# EAGLE design cpLeoNode_V3_0 (EAGLE 7.7.0)
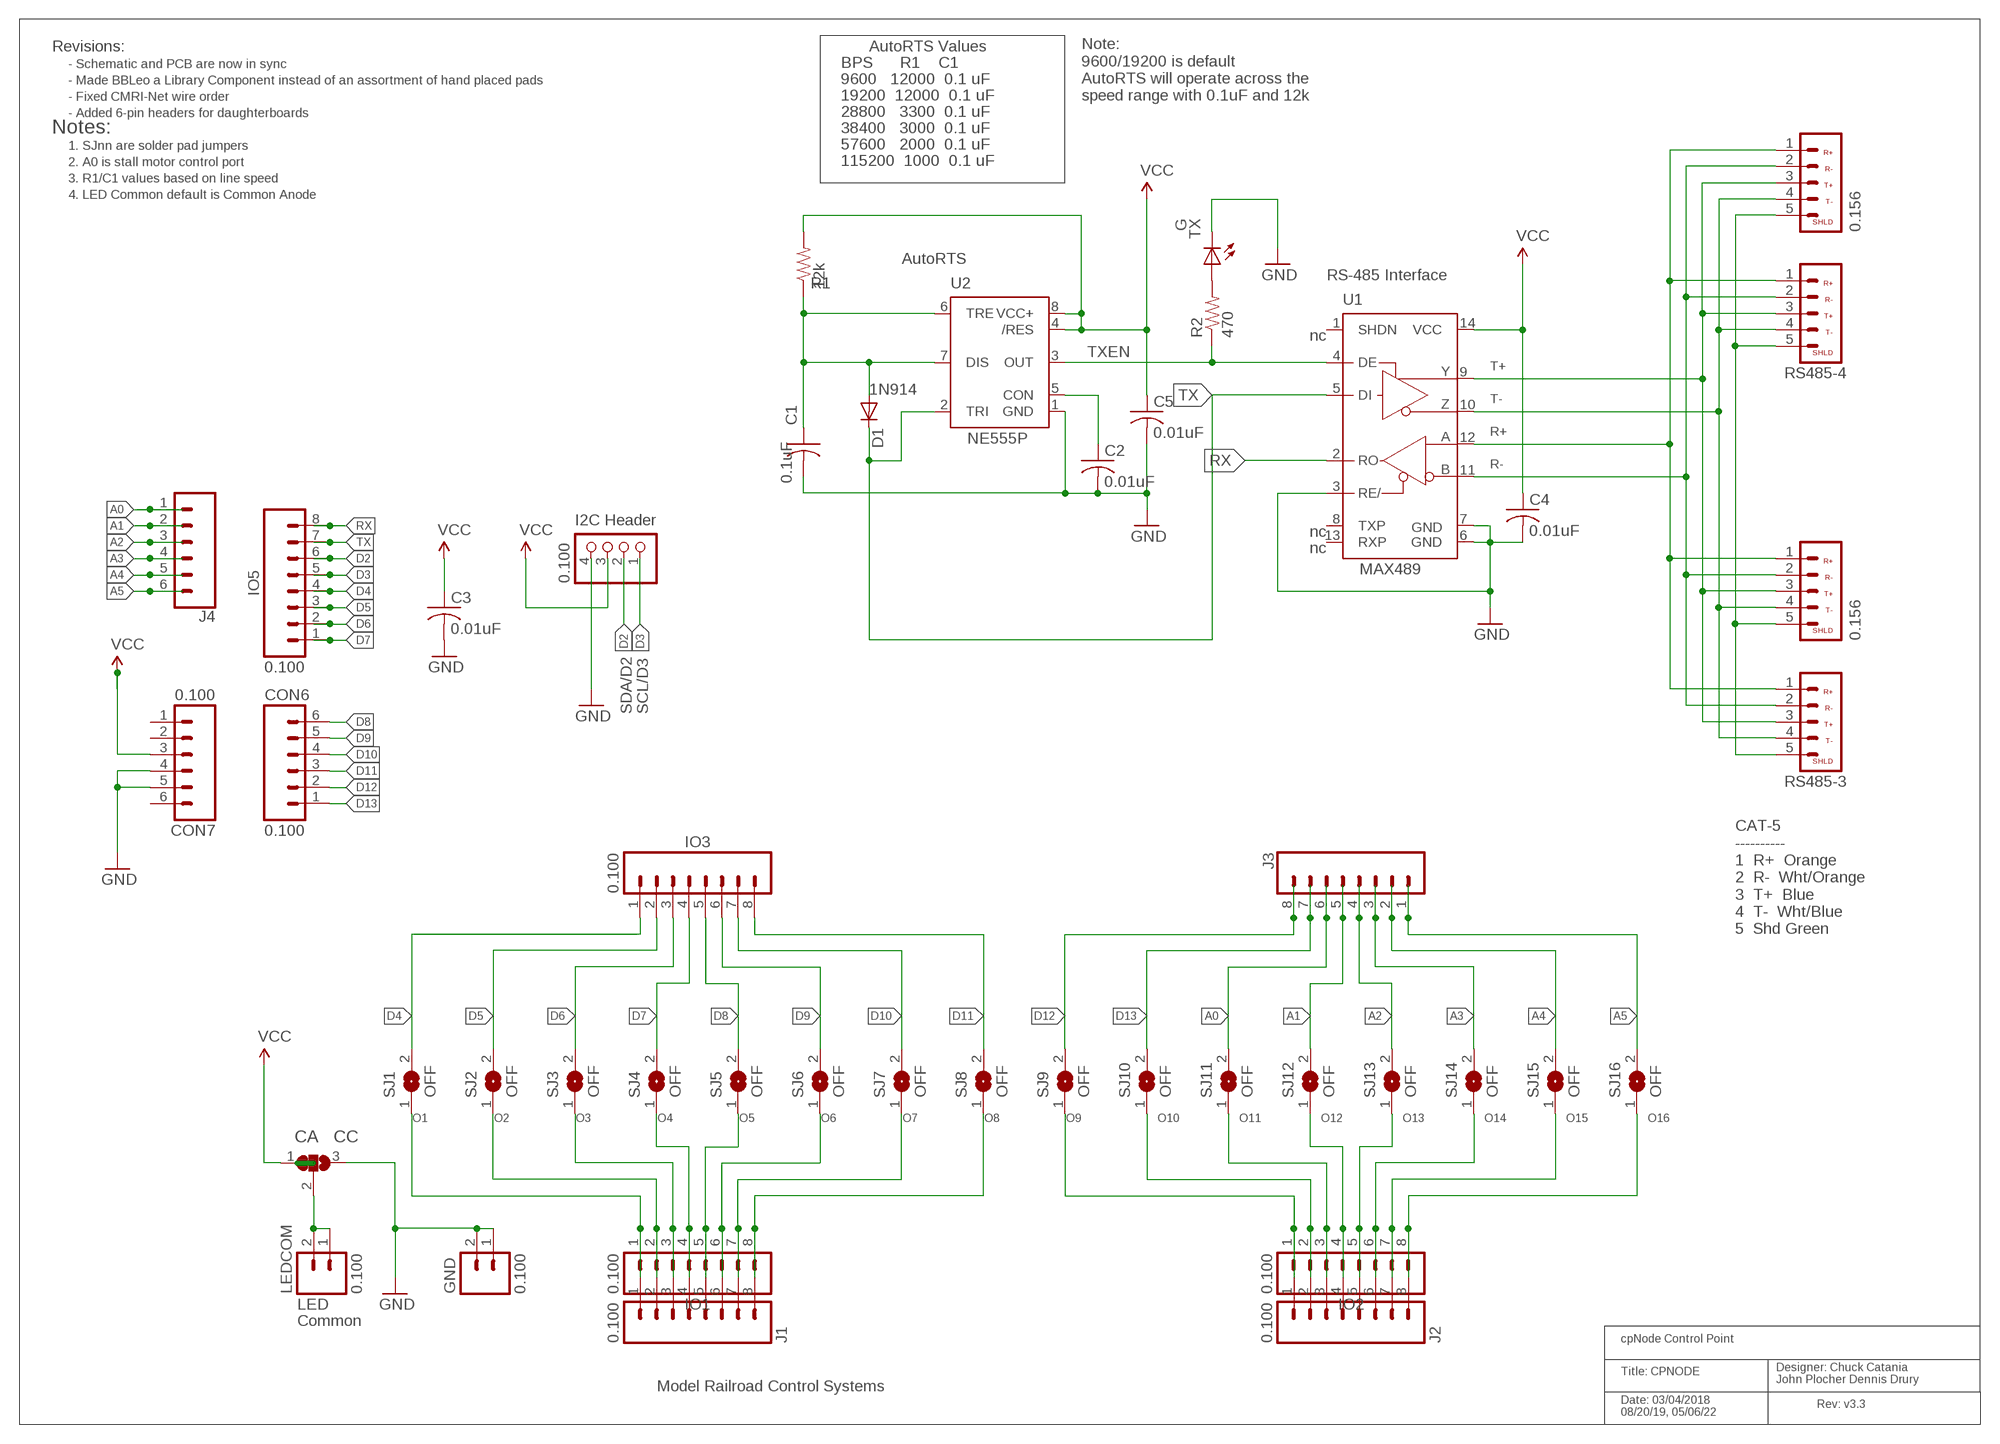
[diagram p0: schematic, sheet 1]

## Parts
C1  0.1uF  CAPPTH2  [C-PTH-0.100]
C2  0.01uF  CAPPTH2  [C-PTH-0.100]
C3  0.01uF  CAPPTH2  [C-PTH-0.100]
C4  0.01uF  CAPPTH2  [C-PTH-0.100]
C5  0.01uF  CAPPTH2  [C-PTH-0.100]
CON6  0.100  CONNECTOR-M06SIP_LOCK  [1X06-SIP_LOCK]
CON7  0.100  CONNECTOR-M06SIP_LOCK  [1X06-SIP_LOCK]
D1  1N4148  DIODE1N4148  [DIODE-1N4148]
GND  0.100  M02POLAR_LOCK  [MOLEX-1X2_LOCK]
I2CHDR  0.100  PINHD-1X4/90  [1X04/90]
IO1  0.100  M081X08  [1X08]
IO2  0.100  M081X08  [1X08]
IO3  0.100  M081X08  [1X08]
IO5  0.100  M081X08  [1X08]
J1  0.100  CONNECTOR-M08LOCK_LONGPADS  [1X08_LOCK_LONGPADS]
J2  0.100  CONNECTOR-M08LOCK_LONGPADS  [1X08_LOCK_LONGPADS]
J3  CONN_08"  [1X08]
J4  CONN_06SILK_FEMALE_PTH  [1X06]
LEDCOM  0.100  M02POLAR_LOCK  [MOLEX-1X2_LOCK]
P1  CA CC  PAD-SOLDERJUMPER-2WAYT  [3P-SMD-2X4.8]
R1  12k  RPTH04  [AXIAL-0.4-RES]
R2  470  RPTH04  [AXIAL-0.4-RES]
RS485-1  0.156  CONNECTOR-CMRINET.156  [KK-156-5]
RS485-2  0.156  CONNECTOR-CMRINET.156  [KK-156-5]
RS485-3  3.5mm  CONNECTOR-CMRINET3.5MM  [CMRINET-3.5MM]
RS485-4  3.5mm  CONNECTOR-CMRINET3.5MM  [CMRINET-3.5MM]
SJ1  OFF  SJ  [SJ]
SJ2  OFF  SJ  [SJ]
SJ3  OFF  SJ  [SJ]
SJ4  OFF  SJ  [SJ]
SJ5  OFF  SJ  [SJ]
SJ6  OFF  SJ  [SJ]
SJ7  OFF  SJ  [SJ]
SJ8  OFF  SJ  [SJ]
SJ9  OFF  SJ  [SJ]
SJ10  OFF  SJ  [SJ]
SJ11  OFF  SJ  [SJ]
SJ12  OFF  SJ  [SJ]
SJ13  OFF  SJ  [SJ]
SJ14  OFF  SJ  [SJ]
SJ15  OFF  SJ  [SJ]
SJ16  OFF  SJ  [SJ]
TX  G  LEDLED3MM  [LED3MM]
U1  MAX3465CPD  [DIL14]
U2  NE555P  [DIL-08]

## Nets
A0: J3.6 J4.1 SJ11.2
A1: J3.5 J4.2 SJ12.2
A2: J3.4 J4.3 SJ13.2
A3: J3.3 J4.4 SJ14.2
A4: J3.2 J4.5 SJ15.2
A5: J3.1 J4.6 SJ16.2
D2: I2CHDR.2 IO5.6
D3: I2CHDR.1 IO5.5
D4: IO3.1 IO5.4 SJ1.2
D5: IO3.2 IO5.3 SJ2.2
D6: IO3.3 IO5.2 SJ3.2
D7: IO3.4 IO5.1 SJ4.2
D8: CON6.6 IO3.5 SJ5.2
D9: CON6.5 IO3.6 SJ6.2
D10: CON6.4 IO3.7 SJ7.2
D11: CON6.3 IO3.8 SJ8.2
D12: CON6.2 J3.8 SJ9.2
D13: CON6.1 J3.7 SJ10.2
GND: C1.2 C2.2 C3.2 C4.2 C5.2 CON7.4 CON7.5 GND.1 GND.2 I2CHDR.4 P1.3 TX.K(C) U1.3(RE/) U1.6(GND) U1.7(GND) U2.1(GND)
N$29: R2.P$2 TX.A
N$38: C2.1 U2.5(CON)
N$45: LEDCOM.1 LEDCOM.2 P1.2
N$52: C1.1 D1.A R1.P$1 U2.6(TRE) U2.7(DIS)
N$54: R2.P$1 U1.4(DE) U2.3(OUT)
O1: IO1.1 J1.1 SJ1.1
O2: IO1.2 J1.2 SJ2.1
O3: IO1.3 J1.3 SJ3.1
O4: IO1.4 J1.4 SJ4.1
O5: IO1.5 J1.5 SJ5.1
O6: IO1.6 J1.6 SJ6.1
O7: IO1.7 J1.7 SJ7.1
O8: IO1.8 J1.8 SJ8.1
O9: IO2.1 J2.1 SJ9.1
O10: IO2.2 J2.2 SJ10.1
O11: IO2.3 J2.3 SJ11.1
O12: IO2.4 J2.4 SJ12.1
O13: IO2.5 J2.5 SJ13.1
O14: IO2.6 J2.6 SJ14.1
O15: IO2.7 J2.7 SJ15.1
O16: IO2.8 J2.8 SJ16.1
R+: RS485-1.1 RS485-2.1 RS485-3.1 RS485-4.1 U1.12(A)
R-: RS485-1.2 RS485-2.2 RS485-3.2 RS485-4.2 U1.11(B)
RX: IO5.8 U1.2(RO)
SHIELD: RS485-1.5 RS485-2.5 RS485-3.5 RS485-4.5
T+: RS485-1.3 RS485-2.3 RS485-3.3 RS485-4.3 U1.9(Y)
T-: RS485-1.4 RS485-2.4 RS485-3.4 RS485-4.4 U1.10(Z)
TX: D1.C IO5.7 U1.5(DI) U2.2(TRI)
VCC: C3.1 C4.1 C5.1 CON7.3 I2CHDR.3 P1.1 R1.P$2 U1.14(VCC) U2.4(/RES) U2.8(VCC+)
Unconnected: CON7.1 CON7.2 CON7.6 U1.1(SHDN) U1.8(TXP) U1.13(RXP)

## Notes on the sheet
- Revisions: | AutoRTS Values
- - Schematic and PCB are now in sync | BPS      R1    C1
- - Made BBLeo a Library Component instead of an assortment of hand placed pads | 9600   12000  0.1 uF
- - Fixed CMRI-Net wire order | 19200  12000  0.1 uF
- Note: 
  9600/19200 is default
  AutoRTS will operate across the
  speed range with 0.1uF and 12k
- - Added 6-pin headers for daughterboards | 28800   3300  0.1 uF
- Notes: | 38400   3000  0.1 uF
- 1. SJnn are solder pad jumpers | 57600   2000  0.1 uF
- 2. A0 is stall motor control port | 115200  1000  0.1 uF
- 3. R1/C1 values based on line speed
- 4. LED Common default is Common Anode
- AutoRTS
- RS-485 Interface
- nc
- TXEN
- T+
- 1N914
- T-
- R+
- R-
- I2C Header | nc
- nc
- MAX489
- SDA/D2 | SCL/D3
- CAT-5
  ----------
  1  R+  Orange
  2  R-  Wht/Orange
  3  T+  Blue
  4  T-  Wht/Blue
  5  Shd Green
- LED
- Common
- cpNode Control Point
- Title: CPNODE
- Designer: Chuck Catania
  John Plocher Dennis Drury
- Model Railroad Control Systems
- Rev: v3.3
- Date: 03/04/2018
  08/20/19, 05/06/22

## Library data of the parts
C1-C5 = SPCoast:CAP*
CON6 CON7 = SPCoast:CONNECTOR-M06: Header 6 Standard 6-pin 0.1" header
D1 = SPCoast:DIODE: Diode These are standard reverse protection diodes and small signal diodes. SMA package can handle up to about 1A. SOD-323 can handle about 200mA. What the SOD-323 package when ordering, there are some mfgs out there that are 5-pin packages.
GND LEDCOM = SparkFun:M02: Header 2 Standard 2-pin 0.1" header. Use with straight break away headers (SKU : PRT-00116), right angle break away headers (PRT-00553), swiss pins (PRT-00743), machine pins (PRT-00117), and female headers (PRT-00115). Molex polarized connector foot print use with SKU : PRT-08233 with associated crimp pins and housings.
I2CHDR = pinhead:PINHD-1X4: PIN HEADER
IO1-IO3 IO5 = SparkFun:M08: Header 8 Standard 8-pin 0.1" header. Use with straight break away headers (SKU : PRT-00116), right angle break away headers (PRT-00553), swiss pins (PRT-00743), machine pins (PRT-00117), and female headers (PRT-00115).
J1 J2 = SPCoast:CONNECTOR-M08: Header 8 Standard 8-pin 0.1" header. Use with straight break away headers (SKU : PRT-00116), right angle break away headers (PRT-00553), swiss pins (PRT-00743), machine pins (PRT-00117), and female headers (PRT-00115).
J3 = SparkFun-Connectors:CONN_08: Multi connection point. Often used as Generic Header-pin footprint for 0.1 inch spaced/style header connections On any of the 0.1 inch spaced packages, you can populate with these: Break Away Headers - Straight <https://www.sparkfun.com/products/116> (PRT-00116) Break Away Male Headers - Right Angle <https://www.sparkfun.com/products/553> (PRT-00553) Female Headers <https://www.sparkfun.com/products/115> (PRT-00115) Break Away Headers - Machine Pin <https://www.sparkfun.com/products/117> (PRT-00117) Break Away Female Headers - Swiss Machine Pin <https://www.sparkfun.com/products/743> (PRT-00743) Arduino Stackable Header - 8 Pin <https://www.sparkfun.com/products/9279> (PRT-09279) For SCREWTERMINALS and SPRING TERMINALS visit here: Screw Terimnals on SparkFun.com <https://www.sparkfun.com/search/results?term=Screw+Terminals> (5mm/3.5mm/2.54mm spacing) This device is also useful as a general connection point to wire up your design to another part of your project. Our various solder wires solder well into these plated through hole pads. Hook-Up Wire - Assortment (Stranded, 22 AWG) <https://www.sparkfun.com/products/11375> (PRT-11375) Hook-Up Wire - Assortment (Solid Core, 22 AWG) <https://www.sparkfun.com/products/11367> (PRT-11367) View the entire wire category on our website here <https://www.sparkfun.com/categories/141> Special notes: Molex polarized connector foot print use with SKU : PRT-08231 with associated crimp pins and housings. 1MM SMD Version SKU: PRT-10208 NOTES ON THE VARIANTS LOCK and LOCK_LONGPADS... This footprint was designed to help hold the alignment of a through-hole component (i.e. 6-pin header) while soldering it into place. You may notice that each hole has been shifted either up or down by 0.005 of an inch from it's more standard position (which is a perfectly straight line). This slight alteration caused the pins (the squares in the middle) to touch the edges of the holes. Because they are alternating, it causes a "brace" to hold the component in place. 0.005 has proven to be the perfect amount of "off-center" position when using our standard breakaway headers. Although looks a little odd when you look at the bare footprint, once you have a header in there, the alteration is very hard to notice. Also,if you push a header all the way into place, it is covered up entirely on the bottom side.; PROD_ID: CONN-08438
J4 = SparkFun-Connectors:CONN_06: Multi connection point. Often used as Generic Header-pin footprint for 0.1 inch spaced/style header connections On any of the 0.1 inch spaced packages, you can populate with these: Break Away Headers - Straight <https://www.sparkfun.com/products/116> (PRT-00116) Break Away Male Headers - Right Angle <https://www.sparkfun.com/products/553> (PRT-00553) Female Headers <https://www.sparkfun.com/products/115> (PRT-00115) Break Away Headers - Machine Pin <https://www.sparkfun.com/products/117> (PRT-00117) Break Away Female Headers - Swiss Machine Pin <https://www.sparkfun.com/products/743> (PRT-00743) Arduino Stackable Header - 6 Pin <https://www.sparkfun.com/products/9280> (PRT-09280) For SCREWTERMINALS and SPRING TERMINALS visit here: Screw Terimnals on SparkFun.com <https://www.sparkfun.com/search/results?term=Screw+Terminals> (5mm/3.5mm/2.54mm spacing) This device is also useful as a general connection point to wire up your design to another part of your project. Our various solder wires solder well into these plated through hole pads. Hook-Up Wire - Assortment (Stranded, 22 AWG) <https://www.sparkfun.com/products/11375> (PRT-11375) Hook-Up Wire - Assortment (Solid Core, 22 AWG) <https://www.sparkfun.com/products/11367> (PRT-11367) View the entire wire category on our website here <https://www.sparkfun.com/categories/141>; PROD_ID: CONN-08437
P1 = Discreter:PAD-SOLDERJUMPER-2WAY: Solder Jumper 2 way solder jumper
R1 R2 = SPCoast:R*: Resistor Basic schematic elements and footprints for 0603, 1206, and PTH 1/10th watt (small) resistors.
RS485-1-RS485-4 = SPCoast:CONNECTOR-CMRINET: CMRINet Top 3.5mm Screw Terminal 5 pos
SJ1-SJ16 = jumper:SJ: SMD solder JUMPER
TX = SPCoast:LED*
U1 = maxim:MAX346*: +5V, Fail-Safe, 40Mbps, Profibus RS-485/RS-422 Transceivers Source: MAX3465-MAX3469.pdf; MPN: MAX3465CPD+; OC_FARNELL: unknown; OC_NEWARK: 42M5444
U2 = SparkFun:NE555: General purpose bipolar Timer; MF: Arrow Electronics; MPN: NE555N; OC_FARNELL: 1467742; OC_NEWARK: 89K1486

## Board
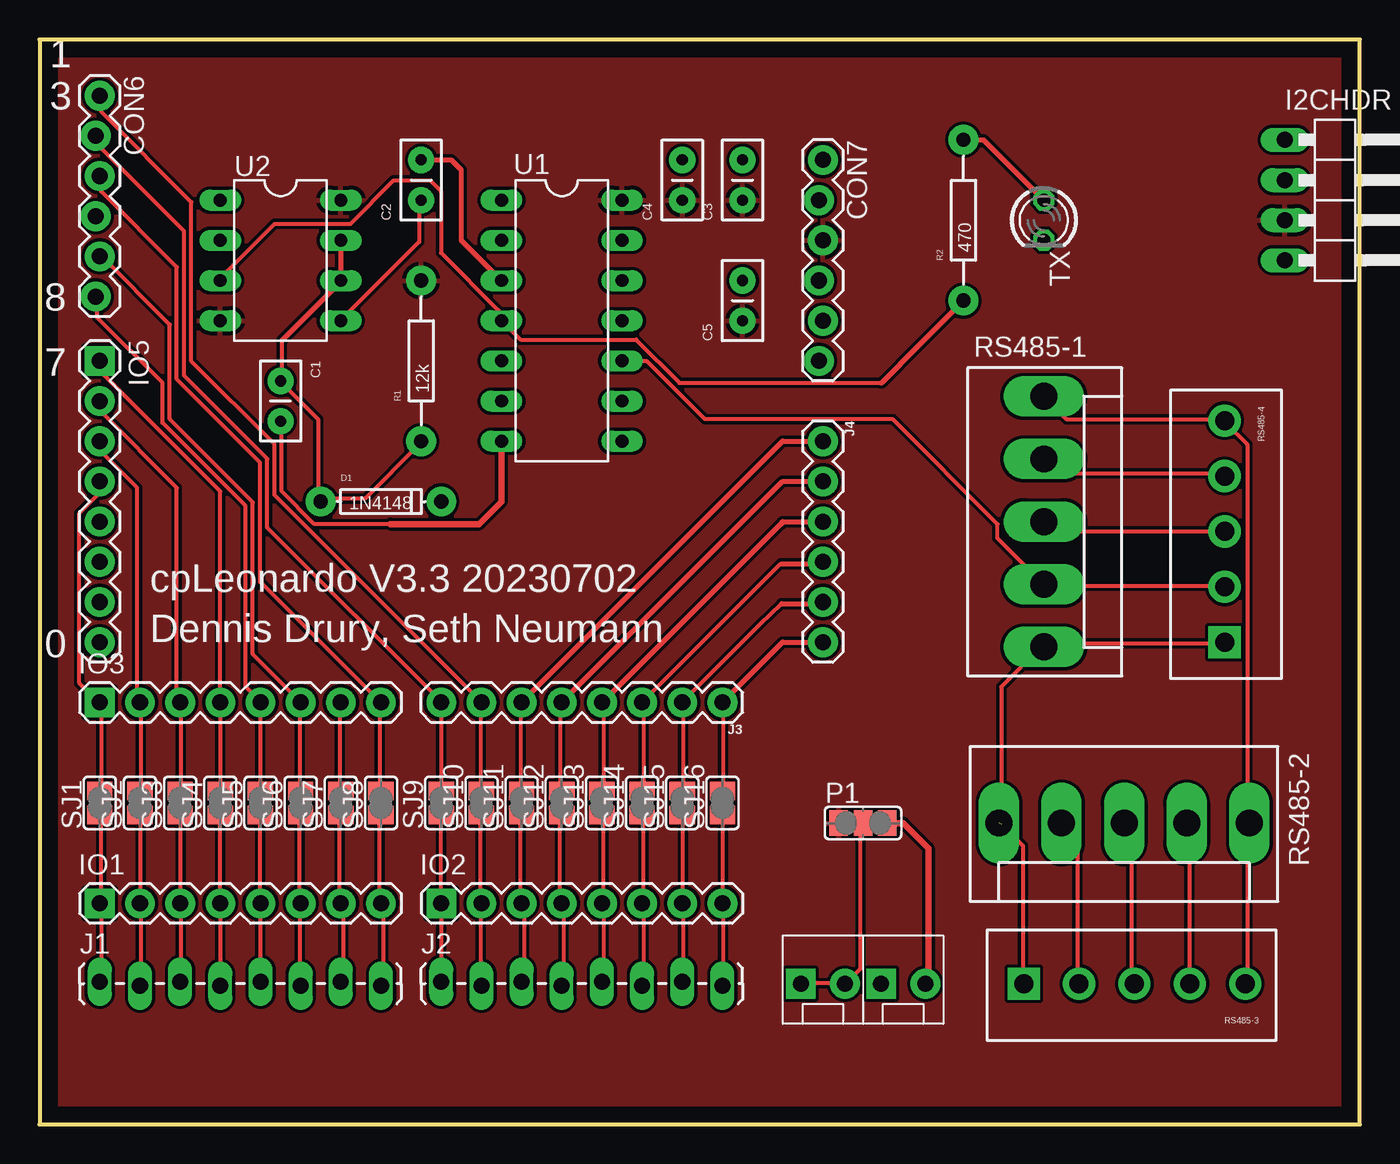
[diagram p1: board, top side]
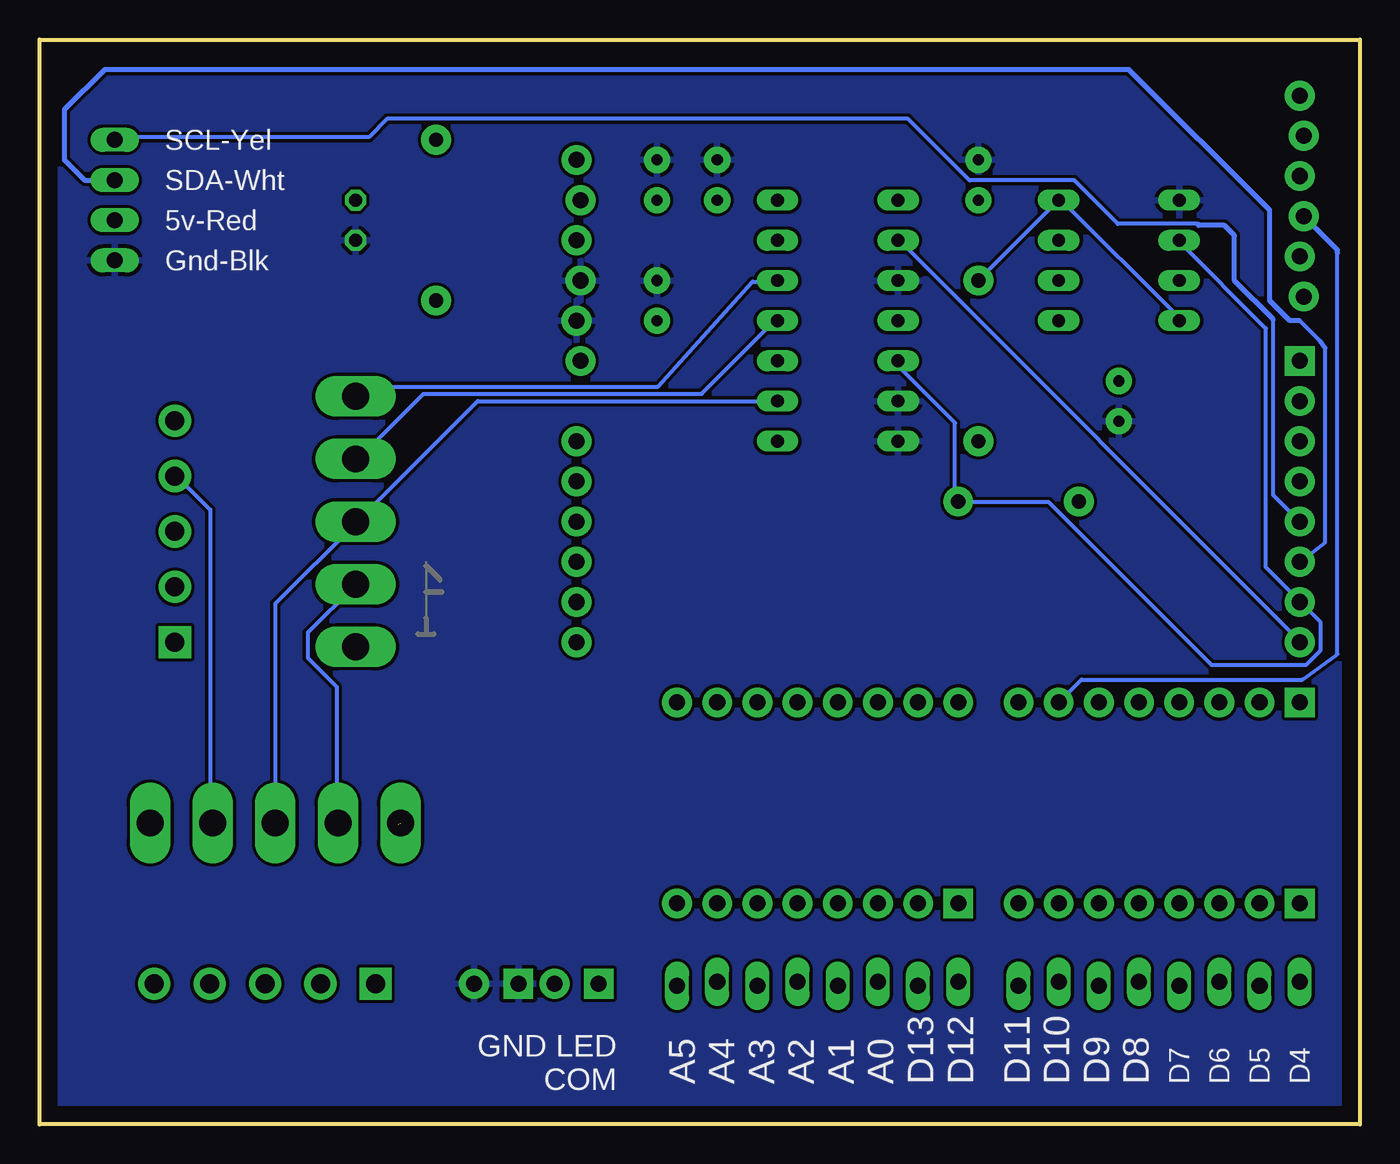
[diagram p2: board, bottom side, seen from below]

Size 83.49 x 68.57 mm. Coordinates in mm from the lower left corner, seen from the top.
Outline: 0,0 83.49,0 83.49,68.57 0,68.57 0,0
Copper layers (1*16): Top 0.035mm / dielectric 1.5mm / Bottom 0.035mm
Design rules "default": minimum track width 10mil, minimum drill 24mil, track to track 8mil, track to pad 8mil, pad to pad 8mil, via to via 8mil, smd to smd 8mil, copper to edge 40mil, drill to drill 8mil, minimum pad ring 10mil, minimum via ring 8mil, stop-mask expansion 4mil, vias tented up to drill 0mil, thermal gap 10mil

### Footprints (pad centres in the part's own frame; a part is rotated, then mirrored left to right if it is on the bottom)
C-PTH-0.100 = drill 0.7 pad 1.651: 1 -1.27,0; 2 1.27,0
1X06-SIP_LOCK = drill 1.016 pad 1.88: 1 0,0; 2 2.54,-0.254; 3 5.08,0; 4 7.62,-0.254; 5 10.16,0; 6 12.7,-0.254
DIODE-1N4148 = drill 0.9 pad 1.88: A 3.81,0; C -3.81,0
MOLEX-1X2_LOCK = drill 1.016 pad 1.88 square: 1 -0.127,0 | drill 1.016 pad 1.88: 2 2.667,0
1X04/90 = drill 1.016 long: 1 -3.81,-3.81; 2 -1.27,-3.81; 3 1.27,-3.81; 4 3.81,-3.81
1X08 = drill 1.016 pad 1.88 square: 1 0,0 | drill 1.016 pad 1.88: 2 2.54,0; 3 5.08,0; 4 7.62,0; 5 10.16,0; 6 12.7,0; 7 15.24,0; 8 17.78,0
1X08_LOCK_LONGPADS = drill 1.016 long: 1 0,0.127; 2 2.54,-0.127; 3 5.08,0.127; 4 7.62,-0.127; 5 10.16,0.127; 6 12.7,-0.127; 7 15.24,0.127; 8 17.78,-0.127
1X08' = drill 1.016 pad 1.88: 1 0,0; 2 2.54,0; 3 5.08,0; 4 7.62,0; 5 10.16,0; 6 12.7,0; 7 15.24,0; 8 17.78,0
1X06 = drill 1.016 pad 1.88: 1 0,0; 2 2.54,0; 3 5.08,0; 4 7.62,0; 5 10.16,0; 6 12.7,0
3P-SMD-2X4.8 = smd 1.168 x 1.6: 1 -1.524,0; 2 0,0; 3 1.524,0
AXIAL-0.4-RES = drill 0.9 pad 1.88: P$1 -5.08,0; P$2 5.08,0
KK-156-5 = drill 1.7 pad 2.184 long: 1 -7.92,0; 2 -3.96,0; 3 0,0; 4 3.96,0; 5 7.92,0
CMRINET-3.5MM = drill 1.2 pad 2.032: 1 -6.38,0; 2 -2.88,0; 3 0.62,0; 4 4.12,0 | drill 1.2 pad 2.032 square: 5 7.62,0
SJ = smd 1.168 x 1.6: 1 -0.762,0; 2 0.762,0
LED3MM = drill 0.813 octagon: A 1.27,0; K -1.27,0
DIL14 = drill 0.813 long: 1 -7.62,-3.81; 2 -5.08,-3.81; 3 -2.54,-3.81; 4 0,-3.81; 5 2.54,-3.81; 6 5.08,-3.81; 7 7.62,-3.81; 8 7.62,3.81; 9 5.08,3.81; 10 2.54,3.81; 11 0,3.81; 12 -2.54,3.81; 13 -5.08,3.81; 14 -7.62,3.81
DIL-08 = drill 0.813 long: 1 -3.81,-3.81; 2 -1.27,-3.81; 3 1.27,-3.81; 4 3.81,-3.81; 5 3.81,3.81; 6 1.27,3.81; 7 -1.27,3.81; 8 -3.81,3.81

### Placement (x,y rotation side)
C1  15.24,45.72 270 top
C2  24.13,59.69 90 top
C3  44.45,59.69 90 top
C4  40.64,59.69 90 top
C5  44.45,52.07 90 top
CON6  3.81,65.02 270 top
CON7  49.53,60.96 270 top
D1  21.59,39.37 180 top
GND  53.34,8.89 0 top
I2CHDR  82.55,58.42 270 top
IO1  3.81,13.97 0 top
IO2  25.4,13.97 0 top
IO3  3.81,26.67 0 top
IO5  3.81,48.26 270 top
J1  3.81,8.89 0 top
J2  25.4,8.89 0 top
J3  [1X08']  43.18,26.67 180 top
J4  49.53,43.18 270 top
LEDCOM  48.26,8.89 0 top
P1  52.07,19.05 0 top
R1  24.13,48.26 90 top
R2  58.42,57.15 90 top
RS485-1  63.5,38.1 270 top
RS485-2  68.58,19.05 180 top
RS485-3  69.85,8.89 180 top
RS485-4  74.93,38.1 270 top
SJ1  3.81,20.32 90 top
SJ2  6.35,20.32 90 top
SJ3  8.89,20.32 90 top
SJ4  11.43,20.32 90 top
SJ5  13.97,20.32 90 top
SJ6  16.51,20.32 90 top
SJ7  19.05,20.32 90 top
SJ8  21.59,20.32 90 top
SJ9  25.4,20.32 90 top
SJ10  27.94,20.32 90 top
SJ11  30.48,20.32 90 top
SJ12  33.02,20.32 90 top
SJ13  35.56,20.32 90 top
SJ14  38.1,20.32 90 top
SJ15  40.64,20.32 90 top
SJ16  43.18,20.32 90 top
TX  63.5,57.15 90 top
U1  33.02,50.8 270 top
U2  15.24,54.61 270 top
U$1  [CA-PROP65WARNING]  37.47,33.66 0 top
U$2  [MRCSLOGOBTM]  52.7,30.48 0 top

### Tracks (layer width: path | path; a pad name or v marks a point on that pad's centre or on a via)
A0
  Top 0.254: SJ11.2 30.4,21.26 30.4,26.52 J3.6
  Top 0.305: J3.6 46.99,43.18 J4.1
A1
  Top 0.254: SJ12.2 32.92,21.26 32.92,26.52 J3.5
  Top 0.305: J3.5 46.99,40.64 J4.2
A2
  Top 0.254: SJ13.2 35.66,21.26 35.66,26.52 J3.4 35.66,26.75 | 46.86,37.95 46.91,37.95
  Top 0.305: 35.66,26.75 46.86,37.95 | 46.91,37.95 46.91,38.02 46.99,38.1 J4.3
A3
  Top 0.254: SJ14.2 38.18,21.26 38.18,26.52 J3.3 46.86,35.43 46.91,35.43
  Top 0.305: 46.91,35.43 49.4,35.43 J4.4
A4
  Top 0.254: SJ15.2 40.69,21.26 40.69,26.52 J3.2 40.69,26.75 45.59,31.65 46.91,32.92
  Top 0.305: 46.91,32.92 49.43,32.92 J4.5
A5
  Top 0.254: SJ16.2 43.2,21.26 43.2,26.52 J3.1
  Top 0.305: J3.1 46.99,30.48 J4.6
D2
  Bottom 0.254: 2.2,49.06 2.2,36.8 3.66,35.66 IO5.6 | 2.52,49.51 3.81,50.8
  Bottom 0.305: 2.2,49.06 2.52,49.51 | 3.81,50.8 4.45,50.8 5.71,52.07 5.71,57.78 14.61,66.67 79.38,66.67 81.92,64.14 81.92,60.96 80.64,59.69 I2CHDR.2
D3
  Bottom 0.254: 10.29,56.92 15.32,56.92 18.06,59.66 24.69,59.66 28.57,63.55 61.52,63.55 62.66,62.41 78.64,62.41 I2CHDR.1 | 5.49,50.85 5.49,39.78 IO5.5
  Bottom 0.305: 5.49,50.85 5.49,50.89 7.94,53.34 7.94,56.2 8.57,56.83 10.2,56.83 10.29,56.92
D4
  Top 0.254: SJ1.2 3.89,21.26 3.89,26.52 IO3.1 3.66,26.75 2.52,27.89 2.52,38.63 3.66,39.78 3.66,40.46 IO5.4
D5
  Top 0.254: SJ2.2 6.4,21.26 6.4,26.52 IO3.2 6.17,26.75 6.17,40.23 3.89,42.52 3.89,42.98 IO5.3
D6
  Top 0.254: SJ3.2 8.91,21.26 8.91,26.52 IO3.3 8.69,26.75 8.69,40.23 3.89,45.03 3.89,45.72 IO5.2
D7
  Top 0.254: SJ4.2 IO3.4 11.43,40.01 3.89,47.55 3.89,48.23 IO5.1
D8
  Top 0.254: SJ5.2 13.95,21.26 13.95,26.52 IO3.5 13.95,26.75 13.03,27.66 13.03,39.09 7.77,44.35 7.77,46.86 3.66,50.98 3.66,52.12 CON6.6
D9
  Top 0.254: SJ6.2 16.46,21.26 16.46,26.52 IO3.6 16.46,26.75 13.49,29.72 13.49,39.32 8.23,44.58 8.23,50.56 3.89,54.9 3.89,54.86 CON6.5
D10
  Top 0.254: SJ7.2 18.97,21.26 18.97,26.52 IO3.7
  Bottom 0.254: 1.42,55.09 1.42,29.72 3.66,28.12 17.6,28.12 IO3.7 | 3.43,57.38 CON6.4
  Bottom 0.305: 1.42,55.09 1.42,55.27 CON6.4
D11
  Top 0.254: SJ8.2 21.49,21.26 21.49,26.52 IO3.8 21.49,26.75 13.95,34.29 13.95,41.83 8.69,47.09 8.69,54.18 3.89,58.98 3.89,59.89 CON6.3
D12
  Top 0.254: SJ9.2 25.38,21.26 25.38,26.52 J3.8 25.38,26.75 14.4,37.72 14.4,42.06 9.14,47.32 9.14,56.46 3.66,61.95 3.66,62.41 CON6.2
D13
  Top 0.254: SJ10.2 27.89,21.26 27.89,26.52 J3.7 27.89,26.75 14.86,39.78 14.86,42.98 9.6,48.23 9.6,58.29 3.89,64.01 3.89,64.92 CON6.1
GND
  Top 0.254: 56.01,8.91 GND.2 | 53.26,8.91 GND.1 | 22.17,37.95 17.37,37.95 15.32,40.01 15.32,44.35 C1.2
  Top 0.305: C2.2 26.04,60.96 26.67,60.33 26.67,55.88 U1.3
  Top 0.406: 22.17,37.95 27.79,37.95 29.21,39.37 U1.7 | P1.3 54.61,19.05 56.2,17.46 56.2,9.08 GND.2
  Bottom 0.254: 29.26,53.26 U1.3
  pour Bottom: 0,0 83.82,0 83.82,68.58 0,68.58
N$29
  Top 0.305: R2.P$2 59.69,62.23 TX.A
N$38
  Top 0.254: U2.5 19.2,50.98 24,55.78 24,58.29 C2.1
N$45
  Top 0.254: P1.2 51.89,18.97 51.89,9.83 50.98,8.91 LEDCOM.2 50.75,8.91 48.23,8.91 LEDCOM.1
N$52
  Top 0.254: R1.P$1 24,42.98 20.57,39.55 17.83,39.55 D1.A 17.6,39.55 17.6,44.58 15.32,46.86 C1.1 15.32,47.09 15.32,49.53 15.32,49.61
  Top 0.305: U2.7 U2.6 19.05,53.26 15.32,49.53
N$54
  Top 0.254: U2.3 11.43,53.49 14.86,56.92 19.66,56.92 22.4,59.66 24.69,59.66 25.38,58.98 25.38,55.09 29.03,51.44 29.03,50.98 U1.4 30.4,49.61 37.72,49.61 40.46,46.86 53.17,46.86 | 58.29,51.89 R2.P$1
  Top 0.305: 53.17,46.86 53.26,46.86 54.41,48.01 54.41,48.06 R2.P$1
O1
  Top 0.254: SJ1.1 3.89,19.43 3.89,14.17 IO1.1 3.89,13.95 3.89,9.14 J1.1
O2
  Top 0.254: SJ2.1 6.4,19.43 6.4,14.17 IO1.2 6.4,13.95 6.4,8.91 J1.2
O3
  Top 0.254: SJ3.1 8.91,19.43 8.91,14.17 IO1.3 8.91,13.95 8.91,9.14 J1.3
O4
  Top 0.254: SJ4.1 IO1.4 J1.4
O5
  Top 0.254: SJ5.1 13.95,19.43 13.95,14.17 IO1.5 13.95,13.95 13.95,9.14 J1.5
O6
  Top 0.254: SJ6.1 16.46,19.43 16.46,14.17 IO1.6 16.46,13.95 16.46,8.91 J1.6
O7
  Top 0.254: SJ7.1 18.97,19.43 18.97,14.17 IO1.7 19.2,13.95 19.2,9.14 J1.7
O8
  Top 0.254: SJ8.1 21.49,19.43 21.49,14.17 IO1.8 21.72,13.95 21.72,8.91 J1.8
O9
  Top 0.254: SJ9.1 25.38,19.43 25.38,14.17 IO2.1 25.38,13.95 25.38,9.14 J2.1
O10
  Top 0.254: SJ10.1 27.89,19.43 27.89,14.17 IO2.2 27.89,13.95 27.89,8.91 J2.2
O11
  Top 0.254: SJ11.1 30.4,19.43 30.4,14.17 IO2.3 30.63,13.95 30.63,9.14 J2.3
O12
  Top 0.254: SJ12.1 32.92,19.43 32.92,14.17 IO2.4 33.15,13.95 33.15,8.91 J2.4
O13
  Top 0.254: SJ13.1 35.66,19.43 35.66,14.17 IO2.5 35.66,13.95 35.66,9.14 J2.5
O14
  Top 0.254: SJ14.1 38.18,19.43 38.18,14.17 IO2.6 38.18,13.95 38.18,8.91 J2.6
O15
  Top 0.254: SJ15.1 40.69,19.43 40.69,14.17 IO2.7 40.69,13.95 40.69,9.14 J2.7
O16
  Top 0.254: SJ16.1 43.2,19.43 43.2,14.17 IO2.8 43.2,13.95 43.2,8.91 J2.8
R+
  Top 0.254: RS485-3.1 76.35,8.91 76.35,18.97 RS485-2.1 76.35,19.2 76.35,42.98 74.98,44.35 RS485-4.1 74.75,44.58 64.92,44.58 63.55,45.95 RS485-1.1
  Bottom 0.254: U1.12 37.03,53.26 38.41,53.26 44.4,46.63 62.87,46.63 63.32,46.18 RS485-1.1
R-
  Top 0.254: RS485-3.2 72.69,8.91 72.69,18.97 RS485-2.2 | RS485-4.2 74.75,41.15 64.24,41.15 63.55,41.83 RS485-1.2
  Bottom 0.254: U1.11 37.03,50.75 37.06,50.75 41.63,46.18 59.21,46.18 63.32,42.06 RS485-1.2 | RS485-2.2 72.69,19.2 72.69,38.86 74.75,40.92 RS485-4.2
RX
  Bottom 0.254: U1.2 29.03,55.78 3.89,30.63 IO5.8
SHIELD  (1 unrouted)
  Top 0.254: 60.81,18.97 62.18,17.6 62.18,8.91 RS485-3.5 | RS485-4.5 74.75,30.4 63.55,30.4 RS485-1.5 63.32,30.18 60.81,27.66 60.81,19.2 RS485-2.5
T+
  Top 0.254: RS485-3.3 69.04,8.91 69.04,18.52 68.58,18.97 RS485-2.3 | RS485-4.3 74.75,37.49 64.01,37.49 63.55,37.95 RS485-1.3
  Bottom 0.254: U1.9 55.78,45.72 63.32,38.18 RS485-1.3 63.55,37.95 68.58,32.92 RS485-2.3
T-
  Top 0.254: RS485-3.4 65.61,8.91 65.61,18.06 64.69,18.97 RS485-2.4 | U1.10 37.03,48.23 38.41,48.23 42.06,44.58 53.95,44.58 60.58,37.95 60.58,37.03 63.32,34.29 RS485-1.4 63.55,34.06 74.75,34.06 RS485-4.4
  Bottom 0.254: RS485-2.4 64.69,19.2 64.69,27.66 66.52,29.49 66.52,31.09 63.55,34.06 RS485-1.4
TX
  Bottom 0.254: U1.5 29.03,48.23 29.03,47.78 25.6,44.35 25.6,39.55 D1.C 25.38,39.32 19.66,39.32 9.37,29.03 3.43,29.03 2.52,29.95 2.52,31.77 3.66,32.92 IO5.7 3.89,33.15 5.94,35.2 5.94,50.29 11.43,55.78 U2.2
VCC
  Top 0.254: 50.52,19.2 P1.1
  Bottom 0.254: U2.4 11.43,50.98 18.97,58.52 U2.8 19.2,58.29 24,53.49 R1.P$2
  pour Top: 0,0 83.82,0 83.82,68.58 0,68.58

### Text on the board
tPlace: 1 / 3 | 8 | 7 | cpLeonardo V3.3 20230702 | 0 | Dennis Drury, Seth Neumann
bPlace: SCL-Yel | SDA-Wht | 5v-Red | Gnd-Blk | GND LED / COM | D4 | D5 | D6 | D7 | D11 / D10 / D9 / D8 | A5 / A4 / A3 / A2 / A1 / A0 / D13 / D12